# Altium schematic sheet BW2098_USB.SchDoc: =project_title
size Tabloid; PageSetup: Record=PageOptions|CenterHorizontal=True|CenterVertical=True|PrintScale=0.73|XCorrection=1.00|YCorrection=1.00|PrintKind=0|BorderSize=5000000|LeftOffset=0|BottomOffset=0|Orientation=2|PaperLength=1000|PaperWidth=1000|Scale=100|PaperSource=7|PrintQuality=-4|MediaType=1|DitherType=10|PaperKind=A4|PrintScaleMode=1; CompanyName: Luxonis Holding; Organization: Luxonis Holding; Address1: 1925 Harmony Park Drive; Address2: Westminster, CO; Address3: 80234; Address4: United States; SheetNumber: 11; SheetTotal: 12
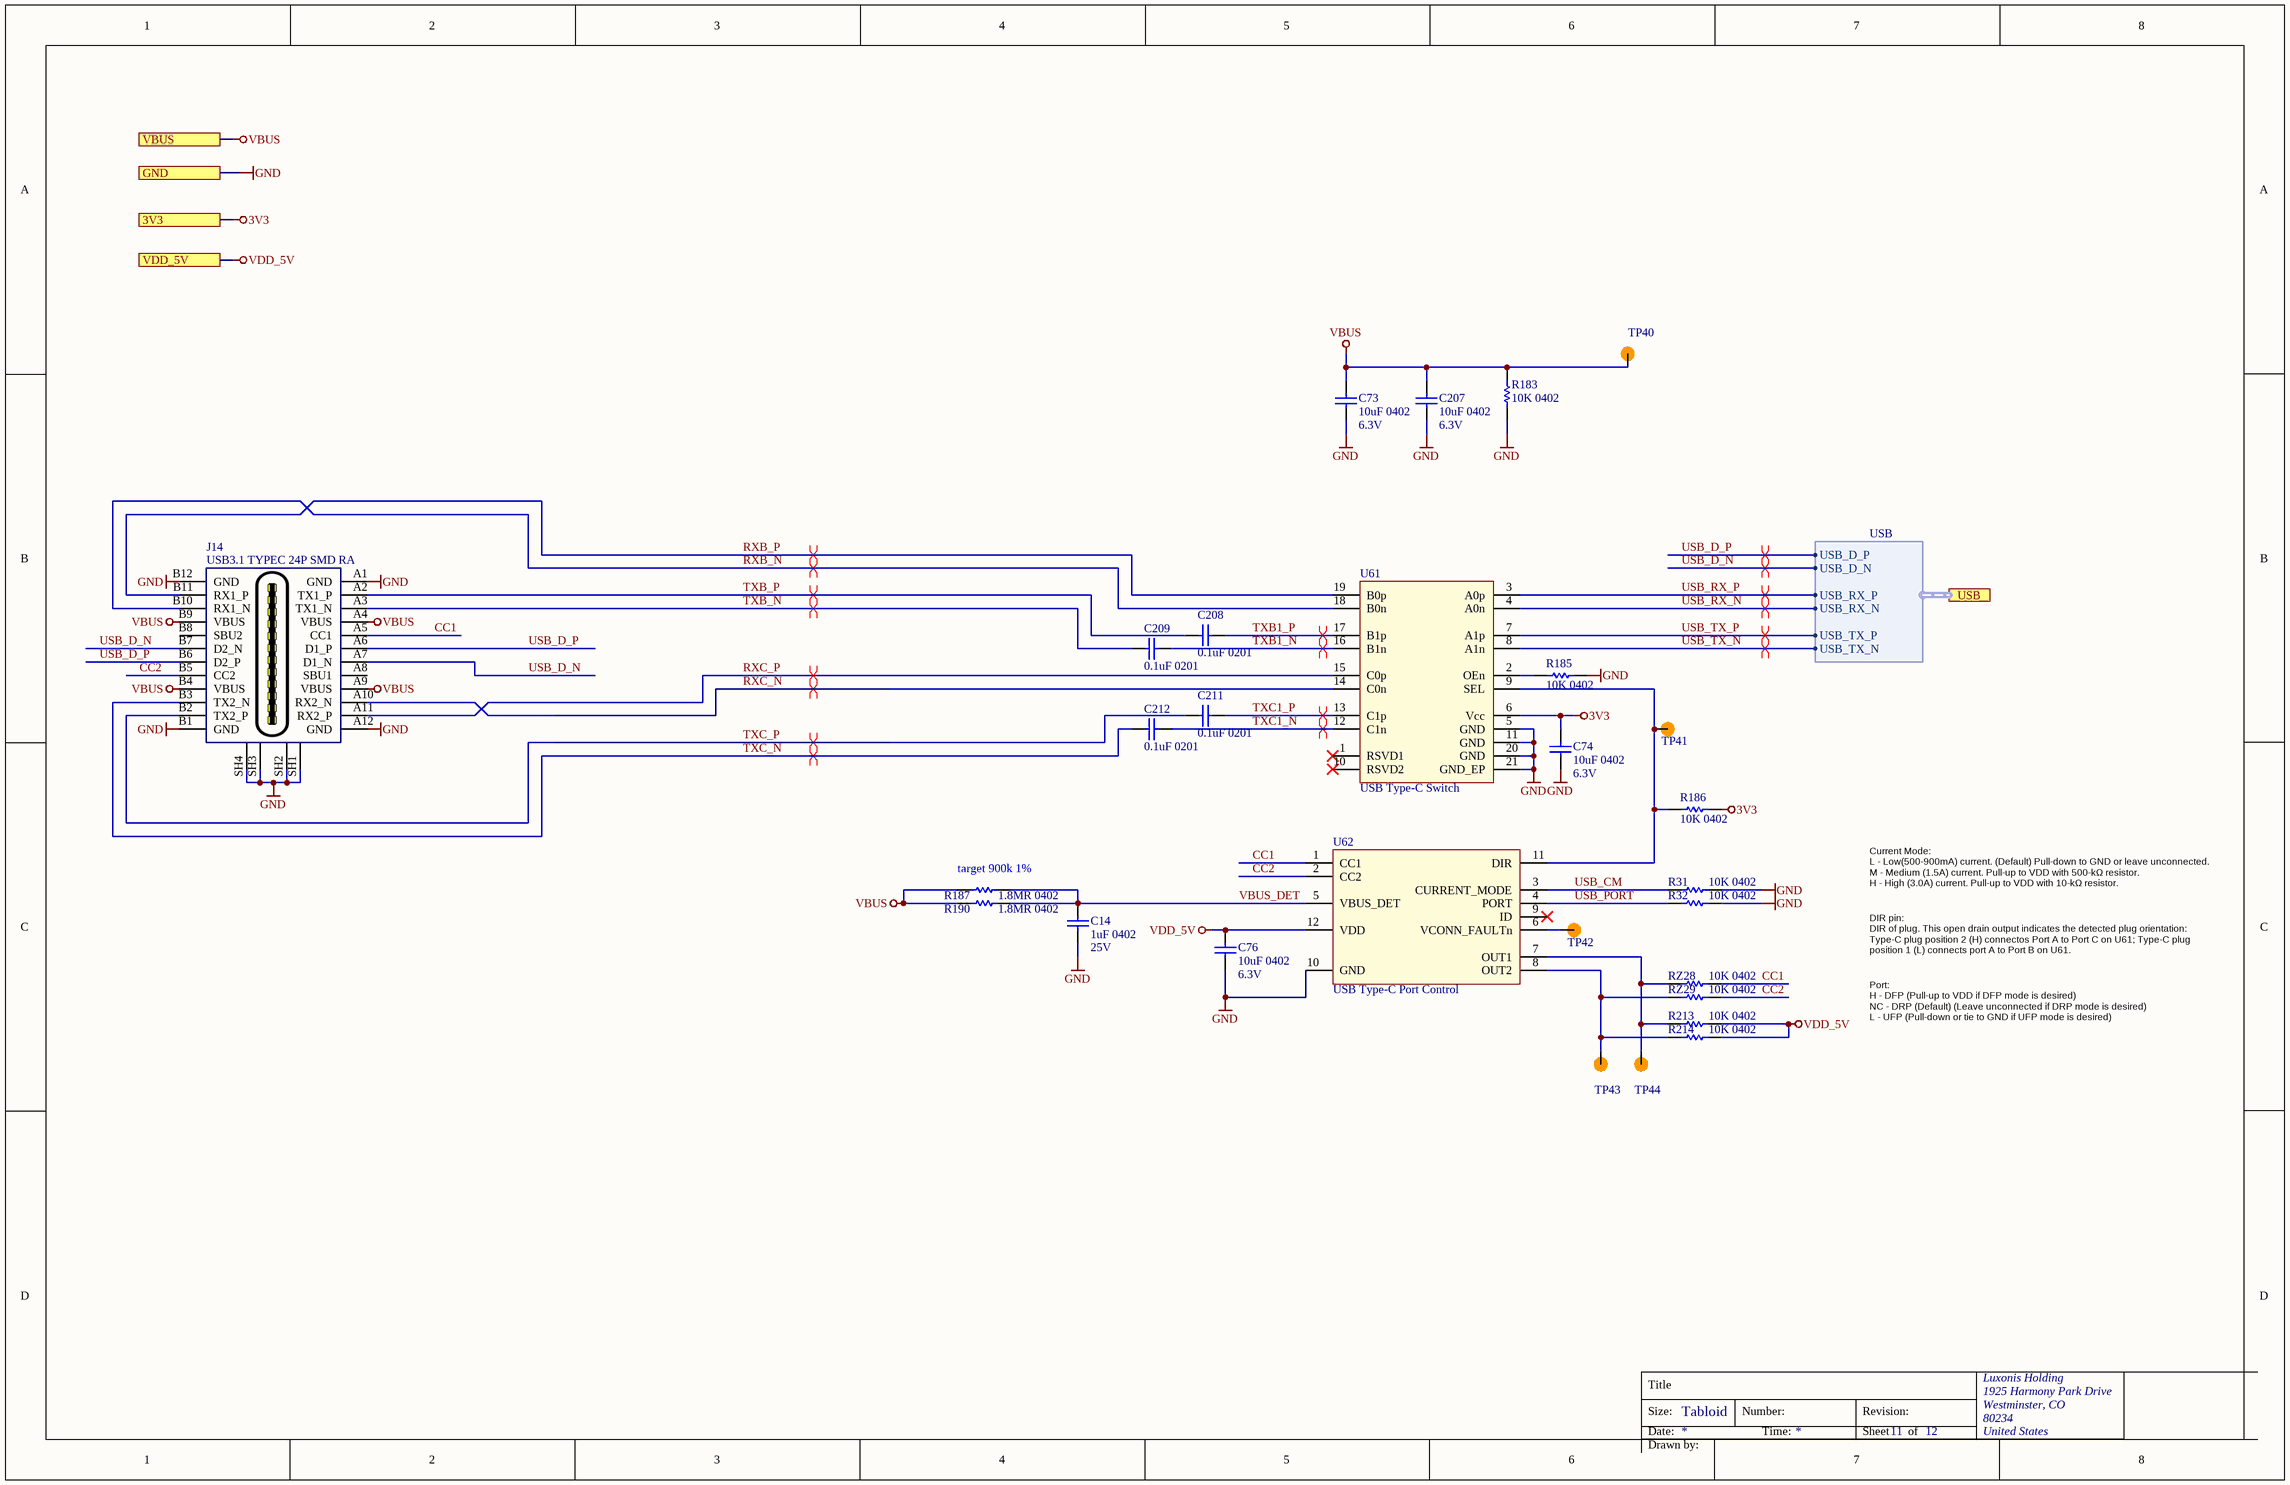
[diagram p0: BW2098_USB.SchDoc]

## Parts
C14  1uF 0402  Voltage Rating: 25V  [CAPC0402(1005)70_N]
C73  10uF 0402  Voltage Rating: 6.3V  [CAPC0402(1005)70_N]
C74  10uF 0402  Voltage Rating: 6.3V  [CAPC0402(1005)70_N]
C76  10uF 0402  Voltage Rating: 6.3V  [CAPC0402(1005)70_N]
C207  10uF 0402  Voltage Rating: 6.3V  [CAPC0402(1005)70_N]
C208  0.1uF 0201  [CAPC0201(0603)33_L]
C209  0.1uF 0201  [CAPC0201(0603)33_L]
C211  0.1uF 0201  [CAPC0201(0603)33_L]
C212  0.1uF 0201  [CAPC0201(0603)33_L]
J14  USB3.1 TYPEC 24P SMD RA  [105450-0101]
R31  10K 0402  [RESC0402(1005)_N]
R32  10K 0402  [RESC0402(1005)_N]
R183  10K 0402  [RESC0402(1005)_N]
R185  10K 0402  [RESC0402(1005)_N]
R186  10K 0402  [RESC0402(1005)_N]
R187  1.8MR 0402  [RESC0402(1005)_N]
R190  1.8MR 0402  [RESC0402(1005)_N]
R213  10K 0402  [RESC0402(1005)_N]
R214  10K 0402  [RESC0402(1005)_N]
RZ28  10K 0402  [RESC0402(1005)_N]
RZ29  10K 0402  [RESC0402(1005)_N]
TP40  TP100_200_NS  [TP100_200_NS]  (value not drawn)  (no BOM)
TP41  TP100_200_NS  [TP100_200_NS]  (value not drawn)  (no BOM)
TP42  TP100_200_NS  [TP100_200_NS]  (value not drawn)  (no BOM)
TP43  TP100_200_NS  [TP100_200_NS]  (value not drawn)  (no BOM)
TP44  TP100_200_NS  [TP100_200_NS]  (value not drawn)  (no BOM)
U61  USB Type-C Switch  [HD3SS3212RKSR]
U62  USB Type-C Port Control  [TUSB321RWBR]

## Ports
3V3, GND, USB (harness USB), VBUS, VDD_5V

## Harnesses
USB: USB_D_P, USB_D_N, USB_TX_N, USB_TX_P, USB_RX_N, USB_RX_P

## Nets
3V3: C74.2 R186.2 U61.6(Vcc) ; port 3V3
GND: C14.1 C73.1 C74.1 C76.1 C207.1 J14.A1(GND) J14.A12(GND) J14.B1(GND) J14.B12(GND) J14.SH1(SH) J14.SH2(SH) J14.SH3(SH) J14.SH4(SH) R31.2 R32.2 R183.1 R185.2 U61.5(GND) U61.11(GND) U61.20(GND) U61.21(GND_EP) U62.10(GND) ; port GND
VBUS: C73.2 C207.2 J14.A4(VBUS) J14.A9(VBUS) J14.B4(VBUS) J14.B9(VBUS) R183.2 R187.1 R190.1 TP40.1 ; port VBUS
VDD_5V: C76.2 R213.2 R214.2 U62.12(VDD) ; port VDD_5V
CC1: J14.A5(CC1) RZ28.2 U62.1(CC1)
CC2: J14.B5(CC2) RZ29.2 U62.2(CC2)
RXB_N: J14.B10(RX1_N) U61.18(B0n)
RXB_P: J14.B11(RX1_P) U61.19(B0p)
RXC_N: J14.A10(RX2_N) U61.14(C0n)
RXC_P: J14.A11(RX2_P) U61.15(C0p)
TXB1_N: C209.2 U61.16(B1n)
TXB1_P: C208.2 U61.17(B1p)
TXB_N: C209.1 J14.A3(TX1_N)
TXB_P: C208.1 J14.A2(TX1_P)
TXC1_N: C212.2 U61.12(C1n)
TXC1_P: C211.2 U61.13(C1p)
TXC_N: C212.1 J14.B3(TX2_N)
TXC_P: C211.1 J14.B2(TX2_P)
USB_CM: R31.1 U62.3(CURRENT_MODE)
USB_D_N: J14.A7(D1_N) J14.B7(D2_N) ; port USB.USB_D_N
USB_D_P: J14.A6(D1_P) J14.B6(D2_P) ; port USB.USB_D_P
USB_PORT: R32.1 U62.4(PORT)
USB_RX_N: U61.4(A0n) ; port USB.USB_RX_N
USB_RX_P: U61.3(A0p) ; port USB.USB_RX_P
USB_TX_N: U61.8(A1n) ; port USB.USB_TX_N
USB_TX_P: U61.7(A1p) ; port USB.USB_TX_P
VBUS_DET: C14.2 R187.2 R190.2 U62.5(VBUS_DET)
NetR185_1: R185.1 U61.2(OEn)
NetR186_1: R186.1 TP41.1 U61.9(SEL) U62.11(DIR)
NetR213_1: R213.1 RZ28.1 TP44.1 U62.7(OUT1)
NetR214_1: R214.1 RZ29.1 TP43.1 U62.8(OUT2)
NetTP42_1: TP42.1 U62.6(VCONN_FAULTn)

Not connected (* = marked no-connect by the designer): J14 A8(SBU1) B8(SBU2); U61 1(RSVD1)* 10(RSVD2)*; U62 9(ID)*

## Layout directives
differential pair; differential pair class USB3: RXB_N, RXB_P, RXC_N, RXC_P, TXB1_N, TXB1_P, TXB_N, TXB_P, TXC1_N, TXC1_P, TXC_N, TXC_P, USB_D_N, USB_D_P, USB_RX_N, USB_RX_P, USB_TX_N, USB_TX_P

## Notes on the sheet
- (near R187) target 900k 1%
- Current Mode:
  L - Low(500-900mA) current. (Default) Pull-down to GND or leave unconnected.
  M - Medium (1.5A) current. Pull-up to VDD with 500-kΩ resistor.
  H - High (3.0A) current. Pull-up to VDD with 10-kΩ resistor.
- DIR pin:
  DIR of plug. This open drain output indicates the detected plug orientation: Type-C plug position 2 (H) connectos Port A to Port C on U61; Type-C plug position 1 (L) connects port A to Port B on U61.
- Port:
  H - DFP (Pull-up to VDD if DFP mode is desired)
  NC - DRP (Default) (Leave unconnected if DRP mode is desired)
  L - UFP (Pull-down or tie to GND if UFP mode is desired)
- Title
- Size:
- Date:
- Tabloid
- Number:
- Time:
- Revision:
- Sheet
- of
- Drawn by:

## Library data of the parts
C14 = GRM155R61E105KA12D: CAP CER 1UF 25V X5R 0402 10%; Manufacturer 1: Murata; Material: Ceramic; Supplier 1: Digi-Key; Manufacturer Part Number 1: GRM155R61E105KA12D; Stock 1: 200653; Pricing 1: 1=0.10000, 10=0.07100, 100=0.03350, 500=0.02352, 1000=0.01947, 2500=0.01812, 5000=0.01658 (USD); RoHS: Yes; Mount: Surface Mount; Case/Package: 0402; Weight: 0.000212oz; Case Code (Metric): 1005; Case Code (Imperial): 0402; Min Operating Temperature: -55°C; Max Operating Temperature: 85°C; Tolerance: 10%; Capacitance: 1uF; Dielectric: X5R; Voltage Rating (DC): 25V; Packaging: Tape and Reel; Package Quantity: 10000; Termination: SMD/SMT; Voltage: 25V; Length: 1mm; Height: 0.5mm; Width: 0.5mm; Thickness: 0.022inch; Depth: 0.5mm; Lead Free: Lead Free; REACH SVHC: No SVHC; ComponentLink1URL: https://datasheet.ciiva.com/22732/1666664-22732122.pdf?src-supplier=Element14; ComponentLink1Description: https://datasheet.ciiva.com/22732/1666664-22732122.pdf?src-supplier=Element14; ComponentLink2URL: https://datasheet.ciiva.com/7719/1666664-7719006.pdf?src-supplier=Element14; ComponentLink2Description: https://datasheet.ciiva.com/7719/1666664-7719006.pdf?src-supplier=Element14; Supplier Part Number 1: 490-10017-1-ND; Supplier 2: Arrow; Supplier 3: TTI; Supplier Part Number 2: GRM155R61E105KA12D; Supplier Part Number 3: GRM155R61E105KA12D
C73 C74 C76 C207 = GRM155R60J106ME15D: CAP CER 10UF 6.3V X5R 0402 20%; Manufacturer 1: Murata; Supplier 1: Digi-Key; Manufacturer Part Number 1: GRM155R60J106ME15D; Stock 1: 1839627; Pricing 1: 1=0.23000, 10=0.15700, 100=0.07950, 500=0.05442, 1000=0.04814, 2500=0.04605, 5000=0.04186 (USD); RoHS: Yes; Mount: Surface Mount; Case/Package: 0402; Case Code (Metric): 1005; Case Code (Imperial): 0402; Min Operating Temperature: -55°C; Max Operating Temperature: 85°C; Packaging: Tape and Reel; Capacitance: 10uF; Dielectric: X5R; Length: 0.039inch; Width: 0.02inch; ComponentLink1URL: https://www.murata.com/~/media/webrenewal/support/library/catalog/products/capacitor/mlcc/c02e.ashx?la=en-us&src-supplier=Digi-Key; ComponentLink1Description: https://www.murata.com/~/media/webrenewal/support/library/catalog/products/capacitor/mlcc/c02e.ashx?la=en-us&src-supplier=Digi-Key; Supplier Part Number 1: 490-13238-1-ND; Voltage Rating (DC): 6.3V; Thickness: 0.026inch; Tolerance: 20%
C208 C209 C211 C212 = GRM033R61A104KE15D: CAP CER 0.1UF 10V X5R 0201; Manufacturer 1: Murata; Capacitance: 100nF; Tolerance: 10%; Supplier 1: Digi-Key; Manufacturer Part Number 1: GRM033R61A104KE15D; Stock 1: 45335312; Pricing 1: 1=0.10000, 10=0.04200, 100=0.01860, 500=0.01330, 1000=0.01045, 2500=0.00950, 5000=0.00874 (USD); RoHS: Yes; Mount: Surface Mount; Case/Package: 0201; Weight: 6E-06oz; Case Code (Metric): 0603; Case Code (Imperial): 0201; Min Operating Temperature: -55°C; Max Operating Temperature: 85°C; Packaging: Tape and Reel; Voltage Rating: 10V; Package Quantity: 1; Voltage Rating (DC): 10V; Dielectric: X5R; Termination: SMD/SMT; Length: 0.6mm; Height: 0.3mm; Width: 0.012inch; Thickness: 0.013inch; Depth: 0.3mm; Radiation Hardening: No; Lead Free: Lead Free; REACH SVHC: No SVHC; ComponentLink1URL: https://datasheet.ciiva.com/26843/getdatasheetpartid-308656-26843739.pdf?src-supplier=Verical; ComponentLink1Description: https://datasheet.ciiva.com/26843/getdatasheetpartid-308656-26843739.pdf?src-supplier=Verical; ComponentLink2URL: https://datasheet.ciiva.com/5413/product-5413117.pdf?src-supplier=Mouser; ComponentLink2Description: https://datasheet.ciiva.com/5413/product-5413117.pdf?src-supplier=Mouser; ComponentLink3URL: https://datasheet.ciiva.com/6256/partnumbering-e-01-6256406.pdf?src-supplier=Digi-Key; ComponentLink3Description: https://datasheet.ciiva.com/6256/partnumbering-e-01-6256406.pdf?src-supplier=Digi-Key; ComponentLink4URL: https://datasheet.ciiva.com/6256/partnumbering-e-01-6256407.pdf?src-supplier=Digi-Key; ComponentLink4Description: https://datasheet.ciiva.com/6256/partnumbering-e-01-6256407.pdf?src-supplier=Digi-Key; ComponentLink5URL: https://datasheet.ciiva.com/6256/partnumbering-e-01-6256408.pdf?src-supplier=Digi-Key; ComponentLink5Description: https://datasheet.ciiva.com/6256/partnumbering-e-01-6256408.pdf?src-supplier=Digi-Key; Supplier Part Number 1: 490-5881-1-ND; Voltage: 10V
J14 = 105450-0101: CONN RCP USB3.1 TYPEC 24P SMD RA; Manufacturer 1: Molex; Connector Type: USB; Number of Contacts: 24; Gender: Receptacle; Number of Ports: 1; Current Rating: 5A; Mating Cycles: 10000; Shielding: Shielded; Pitch: 0.5mm; Supplier 1: Digi-Key; Manufacturer Part Number 1: 105450-0101; Stock 1: 13882; Pricing 1: 1=2.15000, 10=1.94900, 25=1.82960, 50=1.75000, 100=1.67050, 250=1.51140, 500=1.39208 (USD); RoHS: Yes; Mount: Surface Mount,Through Hole,Horizontal; Case/Package: 0101; Number of Pins: 24; Contact Material: Copper Alloy; Contact Plating: Gold; Number of Terminals: 24; Housing Material: Thermoplastic; Insulation Color: Black; Min Operating Temperature: -30°C; Max Operating Temperature: 85°C; Packaging: Tape and Reel; Orientation: Right Angle; Termination: Solder; USB Standard: USB 3.1; Features: Shielded; Length: 8.94mm; REACH SVHC: Unknown; Flammability Rating: UL94 V-0; ComponentLink1URL: http://www.farnell.com/datasheets/2673427.pdf?src-supplier=Farnell; ComponentLink1Description: http://www.farnell.com/datasheets/2673427.pdf?src-supplier=Farnell; ComponentLink2URL: http://www.farnell.com/datasheets/2801634.pdf?src-supplier=Farnell; ComponentLink2Description: http://www.farnell.com/datasheets/2801634.pdf?src-supplier=Farnell; ComponentLink3URL: http://www.farnell.com/datasheets/2672741.pdf?src-supplier=Newark; ComponentLink3Description: http://www.farnell.com/datasheets/2672741.pdf?src-supplier=Newark; ComponentLink4URL: https://www.molex.com/pdm_docs/sd/1054500101_sd.pdf?src-supplier=Digi-Key; ComponentLink4Description: https://www.molex.com/pdm_docs/sd/1054500101_sd.pdf?src-supplier=Digi-Key; ComponentLink5URL: https://www.molex.com/pdm_docs/ps/PS-105448-001.pdf?src-supplier=Digi-Key; ComponentLink5Description: https://www.molex.com/pdm_docs/ps/PS-105448-001.pdf?src-supplier=Digi-Key; ComponentLink6URL: http://www.farnell.com/datasheets/2015275.pdf?src-supplier=Element14; ComponentLink6Description: http://www.farnell.com/datasheets/2015275.pdf?src-supplier=Element14; ComponentLink7URL: http://www.literature.molex.com/SQLImages/kelmscott/Molex/PDF_Images/987651-4081.PDF?src-supplier=Avnet; ComponentLink7Description: http://www.literature.molex.com/SQLImages/kelmscott/Molex/PDF_Images/987651-4081.PDF?src-supplier=Avnet; ComponentLink8URL: http://www.literature.molex.com/SQLImages/kelmscott/Molex/PDF_Images/987651-4081.PDF?src-supplier=Avnet+Asia; ComponentLink8Description: http://www.literature.molex.com/SQLImages/kelmscott/Molex/PDF_Images/987651-4081.PDF?src-supplier=Avnet+Asia; Supplier Part Number 1: WM12856CT-ND
R31 R32 R183 R185 R186 R213 R214 RZ28 RZ29 = RC0402FR-1310KL: RES SMD 10K OHM 1% 0402 1/16W Chip Resistor, 0402 [1005 Metric], 10 kohm, RC Series, 50 V, Thick Film, 62.5 mW; Manufacturer 1: Yageo; Resistance: 10kR; Temperature Coefficient: 100ppm/°C; Power Rating: 62.5mW; Voltage Rating: 50V; ComponentLink1URL: https://datasheet.ciiva.com/16940/pyu-rc0402-51-rohs-l-6-16940293.pdf?src-supplier=Avnet+Europe; ComponentLink1Description: https://datasheet.ciiva.com/16940/pyu-rc0402-51-rohs-l-6-16940293.pdf?src-supplier=Avnet+Europe; ComponentLink2URL: https://datasheet.ciiva.com/28386/pyu-rc0402-51-rohs-l-6-28386855.pdf?src-supplier=Avnet+Europe; ComponentLink2Description: https://datasheet.ciiva.com/28386/pyu-rc0402-51-rohs-l-6-28386855.pdf?src-supplier=Avnet+Europe; ComponentLink3URL: https://datasheet.ciiva.com/16740/pyu-rc0402-51-rohs-l-6-r-16740602.pdf?src-supplier=Future+Electronics; ComponentLink3Description: https://datasheet.ciiva.com/16740/pyu-rc0402-51-rohs-l-6-r-16740602.pdf?src-supplier=Future+Electronics; ComponentLink4URL: https://datasheet.ciiva.com/8891/pyu-rc0402-51-rohs-l-6-8891339.pdf?src-supplier=Avnet; ComponentLink4Description: https://datasheet.ciiva.com/8891/pyu-rc0402-51-rohs-l-6-8891339.pdf?src-supplier=Avnet; ComponentLink5URL: https://datasheet.ciiva.com/5557/pyu-rc0402-51-rohs-l-6-r-5557997.pdf?src-supplier=Mouser; ComponentLink5Description: https://datasheet.ciiva.com/5557/pyu-rc0402-51-rohs-l-6-r-5557997.pdf?src-supplier=Mouser; ComponentLink6URL: https://datasheet.ciiva.com/7983/1018594-7983533.pdf?src-supplier=Element14; ComponentLink6Description: https://datasheet.ciiva.com/7983/1018594-7983533.pdf?src-supplier=Element14; Supplier 1: Newark; Manufacturer Part Number 1: RC0402FR-1310KL; Stock 1: 62239; Pricing 1: 1=0.10000, 25=0.01200, 100=0.00400, 250=0.00400, 500=0.00300, 1000=0.00300 (USD); RoHS: Yes; Case/Package: 0402; Number of Pins: 2; Contact Plating: Tin,Matte,Lead; Case Code (Imperial): 0402; Case Code (Metric): 1005; Min Operating Temperature: -55°C; Max Operating Temperature: 155°C; Tolerance: 1%; Composition: Thick Film; Packaging: Tape and Reel; Termination: SMD/SMT; Military Standard: Not; Voltage Rating (DC): 50V; Working Voltage: 50V; Number of Terminations: 2; Length: 1mm; Depth: 0.5mm; Radiation Hardening: No; REACH SVHC: No SVHC; Lead Free: Lead Free; Supplier Part Number 1: 67R9960
R187 R190 = CRCW04021M80FKED: RES SMD 1.8M OHM 1% 1/16W 0402; Manufacturer 1: Vishay; Voltage Rating: 50V; Temperature Coefficient: 100ppm/°C; Power Rating: 63mW; Supplier 1: Digi-Key; Manufacturer Part Number 1: CRCW04021M80FKED; Stock 1: 26061; Pricing 1: 1=0.10000, 10=0.03800, 100=0.01540, 1000=0.00690, 2500=0.00599, 5000=0.00495 (USD); RoHS: Yes; Mount: Surface Mount; Case/Package: 0402; Number of Pins: 2; Weight: 2.3E-05oz; Case Code (Imperial): 0402; Case Code (Metric): 1005; Contact Plating: Tin; Min Operating Temperature: -55°C; Max Operating Temperature: 155°C; Packaging: Tape and Reel; Package Quantity: 10000; Termination: SMD/SMT; Voltage Rating (DC): 50V; Composition: Thick Film; Tolerance: 1%; Military Standard: Not; Resistance: 1.8MR; Length: 1mm; Height: 0.35mm; Width: 0.5mm; Depth: 0.5mm; Radiation Hardening: No; Lead Free: Lead Free; REACH SVHC: Unknown; ComponentLink1URL: https://datasheet.ciiva.com/11812/0900766b80d98824-11812579.pdf?src-supplier=RSComponents; ComponentLink1Description: https://datasheet.ciiva.com/11812/0900766b80d98824-11812579.pdf?src-supplier=RSComponents; ComponentLink2URL: https://datasheet.ciiva.com/16886/dcrcwe3-16886536.pdf?src-supplier=Avnet+Europe; ComponentLink2Description: https://datasheet.ciiva.com/16886/dcrcwe3-16886536.pdf?src-supplier=Avnet+Europe; ComponentLink3URL: https://datasheet.ciiva.com/7800/1697337-7800987.pdf?src-supplier=Element14; ComponentLink3Description: https://datasheet.ciiva.com/7800/1697337-7800987.pdf?src-supplier=Element14; ComponentLink4URL: https://datasheet.ciiva.com/16786/70201119-16786875.pdf?src-supplier=Allied+Electronics; ComponentLink4Description: https://datasheet.ciiva.com/16786/70201119-16786875.pdf?src-supplier=Allied+Electronics; ComponentLink5URL: https://datasheet.ciiva.com/22676/1700796-22676027.pdf?src-supplier=Element14; ComponentLink5Description: https://datasheet.ciiva.com/22676/1700796-22676027.pdf?src-supplier=Element14; ComponentLink6URL: https://datasheet.ciiva.com/7800/1697337-7800988.pdf?src-supplier=Element14; ComponentLink6Description: https://datasheet.ciiva.com/7800/1697337-7800988.pdf?src-supplier=Element14; ComponentLink7URL: https://datasheet.ciiva.com/26316/fld-crcw-e3-data-en-26316605.pdf?src-supplier=Distrelec; ComponentLink7Description: https://datasheet.ciiva.com/26316/fld-crcw-e3-data-en-26316605.pdf?src-supplier=Distrelec; ComponentLink8URL: https://datasheet.ciiva.com/8336/dcrcwe3-8336646.pdf?src-supplier=Avnet; ComponentLink8Description: https://datasheet.ciiva.com/8336/dcrcwe3-8336646.pdf?src-supplier=Avnet; Supplier Part Number 1: 541-1.80MLCT-ND
TP40-TP44 = TEST_POINT
U61 = HD3SS3212RKSR: IC MUX 2:1 8 OHM 20VQFN; Manufacturer 1: Texas Instruments; Bandwidth: 8GHz; Min Supply Voltage: 3V; Max Supply Voltage: 3.6V; Data Rate: 480Mbps; Number of Ports: 3; USB Standard: USB 3.1; Supplier 1: Digi-Key; Manufacturer Part Number 1: HD3SS3212RKSR; Stock 1: 36674; Pricing 1: 1=1.79000, 10=1.61000, 100=1.29440, 500=1.06348, 1000=0.88117 (USD); RoHS: Yes; Mount: Standard; Case/Package: VQFN; Number of Pins: 20; Min Operating Temperature: 0°C; Max Operating Temperature: 70°C; Packaging: Tape and Reel; Lead Free: Lead Free; REACH SVHC: No SVHC; ComponentLink1URL: http://www.ti.com/general/docs/lit/getliterature.tsp?genericPartNumber=HD3SS3212&&fileType=pdf&src-supplier=Avnet; ComponentLink1Description: http://www.ti.com/general/docs/lit/getliterature.tsp?genericPartNumber=HD3SS3212&&fileType=pdf&src-supplier=Avnet; ComponentLink2URL: http://www.ti.com/general/docs/lit/getliterature.tsp?genericPartNumber=HD3SS3212&amp;&amp;fileType=pdf&src-supplier=Farnell; ComponentLink2Description: http://www.ti.com/general/docs/lit/getliterature.tsp?genericPartNumber=HD3SS3212&amp;&amp;fileType=pdf&src-supplier=Farnell; ComponentLink3URL: http://www.ti.com/lit/ds/symlink/hd3ss3212.pdf?src-supplier=Digi-Key; ComponentLink3Description: http://www.ti.com/lit/ds/symlink/hd3ss3212.pdf?src-supplier=Digi-Key; ComponentLink4URL: http://www.ti.com/lit/gpn/hd3ss3212?src-supplier=Mouser; ComponentLink4Description: http://www.ti.com/lit/gpn/hd3ss3212?src-supplier=Mouser; ComponentLink5URL: http://www.ti.com/general/docs/lit/getliterature.tsp?genericPartNumber=HD3SS3212&&fileType=pdf&src-supplier=Element14; ComponentLink5Description: http://www.ti.com/general/docs/lit/getliterature.tsp?genericPartNumber=HD3SS3212&&fileType=pdf&src-supplier=Element14; Supplier Part Number 1: 296-42174-1-ND
U62 = TUSB321RWBR: IC USB PORT CONTROL TYPE-C 12X2Q; Manufacturer 1: Texas Instruments; Min Supply Voltage: 4.5V; Max Supply Voltage: 5.5V; Number of Ports: 1; USB Standard: USB 3.1; Supplier 1: Digi-Key; Manufacturer Part Number 1: TUSB321RWBR; Stock 1: 7746; Pricing 1: 1=2.27000, 10=2.04200, 100=1.64100, 500=1.34828, 1000=1.11714 (USD); RoHS: Yes; Mount: Surface Mount; Number of Pins: 12; Contact Plating: Gold; Min Operating Temperature: 0°C; Max Operating Temperature: 70°C; Packaging: Tape and Reel; REACH SVHC: No SVHC; Lead Free: Lead Free; ComponentLink1URL: http://www.ti.com/general/docs/lit/getliterature.tsp?genericPartNumber=TUSB321&&fileType=pdf&src-supplier=Avnet+Asia; ComponentLink1Description: http://www.ti.com/general/docs/lit/getliterature.tsp?genericPartNumber=TUSB321&&fileType=pdf&src-supplier=Avnet+Asia; ComponentLink2URL: http://www.ti.com/general/docs/lit/getliterature.tsp?genericPartNumber=TUSB321&&fileType=pdf&src-supplier=Farnell; ComponentLink2Description: http://www.ti.com/general/docs/lit/getliterature.tsp?genericPartNumber=TUSB321&&fileType=pdf&src-supplier=Farnell; ComponentLink3URL: http://www.ti.com/lit/ds/symlink/tusb321.pdf?src-supplier=Digi-Key; ComponentLink3Description: http://www.ti.com/lit/ds/symlink/tusb321.pdf?src-supplier=Digi-Key; ComponentLink4URL: http://www.ti.com/general/docs/lit/getliterature.tsp?genericPartNumber=TUSB321&&fileType=pdf&src-supplier=Element14; ComponentLink4Description: http://www.ti.com/general/docs/lit/getliterature.tsp?genericPartNumber=TUSB321&&fileType=pdf&src-supplier=Element14; ComponentLink5URL: http://www.ti.com/general/docs/lit/getliterature.tsp?genericPartNumber=TUSB321&&fileType=pdf&src-supplier=Avnet; ComponentLink5Description: http://www.ti.com/general/docs/lit/getliterature.tsp?genericPartNumber=TUSB321&&fileType=pdf&src-supplier=Avnet; Supplier Part Number 1: 296-42400-1-ND